# Altium schematic sheet LAN.SchDoc
size A4
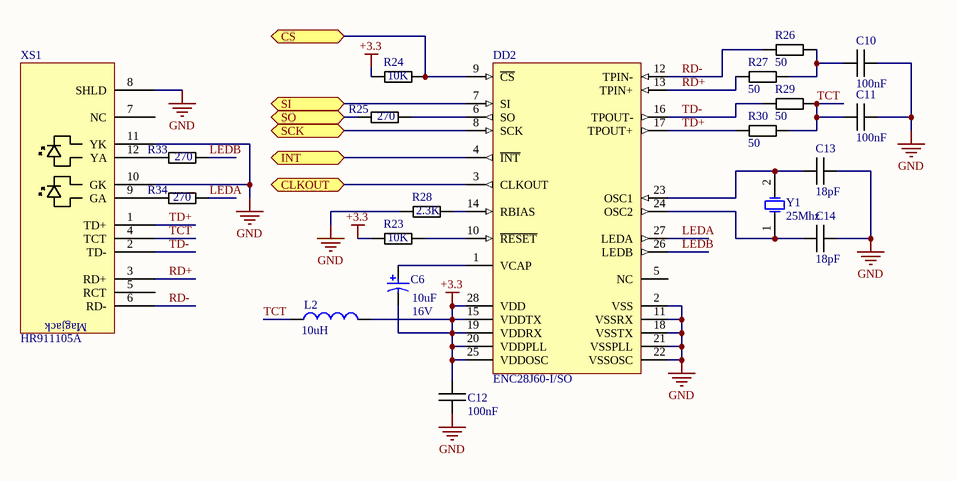
[diagram p0: LAN.SchDoc]

## Parts
C6  Capacitance: 10uF  Voltage: 16V  [CAP_3530]  (hidden comment: CAP_Tantalum)
C10  Val: 100nF  [CAPC1206(3216)170_L]  (hidden comment: CAP_SMD)
C11  Val: 100nF  [CAPC1206(3216)170_L]  (hidden comment: CAP_SMD)
C12  Val: 100nF  [CAPC1206(3216)170_L]  (hidden comment: CAP_SMD)
C13  Val: 18pF  [CAPC1206(3216)170_L]  (hidden comment: CAP_SMD)
C14  Val: 18pF  [CAPC1206(3216)170_L]  (hidden comment: CAP_SMD)
DD2  ENC28J60-I/SO  [SO-28_M]
L2  value 10uH  [IND_1206]  (hidden comment: Inductor)
R23  Val: 10K  [RESC1206(3216)_L]  (hidden comment: RES_SMD)
R24  Val: 10K  [RESC1206(3216)_L]  (hidden comment: RES_SMD)
R25  Val: 270  [RESC1206(3216)_L]  (hidden comment: RES_SMD)
R26  Val: 50  [RESC1206(3216)_L]  (hidden comment: RES_SMD)
R27  Val: 50  [RESC1206(3216)_L]  (hidden comment: RES_SMD)
R28  Val: 2.3K  [RESC1206(3216)_L]  (hidden comment: RES_SMD)
R29  Val: 50  [RESC1206(3216)_L]  (hidden comment: RES_SMD)
R30  Val: 50  [RESC1206(3216)_L]  (hidden comment: RES_SMD)
R33  Val: 270  [RESC1206(3216)_L]  (hidden comment: RES_SMD)
R34  Val: 270  [RESC1206(3216)_L]  (hidden comment: RES_SMD)
XS1  HR911105A  [HR911105A]
Y1  25Mhz  [Crystal_SMD]

## Ports
CLKOUT (bidir), CS (bidir), INT (bidir), SCK (bidir), SI (bidir), SO (bidir)

## Nets
+3.3: C6.2 C12.2 DD2.15(VDDTX) DD2.19(VDDRX) DD2.20(VDDPLL) DD2.25(VDDOSC) DD2.28(VDD) L2.2 R23.1 R24.1
GND: C10.2 C11.2 C12.1 C13.2 C14.2 DD2.2(VSS) DD2.11(VSSRX) DD2.18(VSSTX) DD2.21(VSSPLL) DD2.22(VSSOSC) R28.1 XS1.8(SHLD) XS1.10(GK) XS1.11(YK)
CLKOUT: DD2.3(CLKOUT) ; port CLKOUT
CS: DD2.9(~{CS}) R24.2 ; port CS
INT: DD2.4(~{INT}) ; port INT
LEDA: DD2.27(LEDA) R34.2
LEDB: DD2.26(LEDB) R33.2
RD+: DD2.13(TPIN+) R27.1 XS1.3(RD+)
RD-: DD2.12(TPIN-) R26.1 XS1.6(RD-)
SCK: DD2.8(SCK) ; port SCK
SI: DD2.7(SI) ; port SI
SO: R25.1 ; port SO
TCT: C11.1 L2.1 R29.2 R30.2 XS1.4(TCT)
TD+: DD2.17(TPOUT+) R30.1 XS1.1(TD+)
TD-: DD2.16(TPOUT-) R29.1 XS1.2(TD-)
NetC6_1: C6.1 DD2.1(VCAP)
NetC10_1: C10.1 R26.2 R27.2
NetC13_1: C13.1 DD2.23(OSC1) Y1.2(X2)
NetC14_1: C14.1 DD2.24(OSC2) Y1.1(X1)
NetDD2_6: DD2.6(SO) R25.2
NetDD2_10: DD2.10(~{RESET}) R23.2
NetDD2_14: DD2.14(RBIAS) R28.2
NetR33_1: R33.1 XS1.12(YA)
NetR34_1: R34.1 XS1.9(GA)

Not connected (* = marked no-connect by the designer): DD2 5(NC); XS1 5(RCT) 7(NC)

## Notes on the sheet
- (in symbol RJ-45 HR911105A) Magjack

## Library data of the parts
C10-C14 = CAP_SMD: Ceramic capacitor, 0805
DD2 = ENC28J60-I/SO: Stand-Alone Ethernet Controller with SPI Interface, 28-Pin SOIC, Industrial Temperature; Code_JEDEC: MS-013; ComponentLink2URL: http://ww1.microchip.com/downloads/en/DeviceDoc/39662c.pdf; PackageDescription: 28-Lead Plastic Small Outline (SO) - Wide 7.50mm Body [SOIC]; RevisionNote: URLs added.; ComponentLink2Description: Datasheet; ComponentLink1Description: Manufacturer URL; ComponentLink3Description: Package Specification; DatasheetVersion: revC, Jan-2008; ComponentLink1URL: http://www.microchip.com/; ComponentLink3URL: http://www.microchip.com/stellent/groups/techpub_sg/documents/packagingspec/en012702.pdf; PackageVersion: revBB, Aug-2009; PackageReference: SOIC-SO28
R24 R28 R33 R34 = RES_SMD: RES0805
XS1 = RJ-45 HR911105A: Value: HR911105A; Order: HR911105A
Y1 = Crystal: Low Profile Crystal; Brand: ABRACON; Case Length: 11.4mm; Frequency Stability: 50PPM; ESR: 80Ohms; Case Height: 4.2mm; Tolerance: 30PPM; Frequency: 8MHz; Case Width: 4.7mm; Load Capacitance: 18pF; Datasheet Version: 04/2011; Termination Style: SMD/SMT; Dimensions: 4.7mmWx11.4mmLx4.2mmH; Packaging: Reel; Manufacturer: ABRACON; Package URL: http://www.abracon.com/Support/PackageDrawing/Resonators/ABLS-2D.pdf; Mounting Technology: SurfaceMount; Package Reference: ABLS-14.7456MHZ-B2-T; Product Category: Crystals; Package Description: 2-Pin Surface Mount Device, Body 11.4 x 4.7 mm; Package / Case: HC-49/US; Mounting Style: SMD/SMT; Operating Temperature Range: -20Cto+70C; Series: ABLS; Factory Pack Quantity: 1000; Datasheet URL: http://www.abracon.com/Resonators/abls.pdf; Manufacturer URL: http://www.abracon.com/; RoHS: Details; Type: LowProfileMicroprocessorCrystal